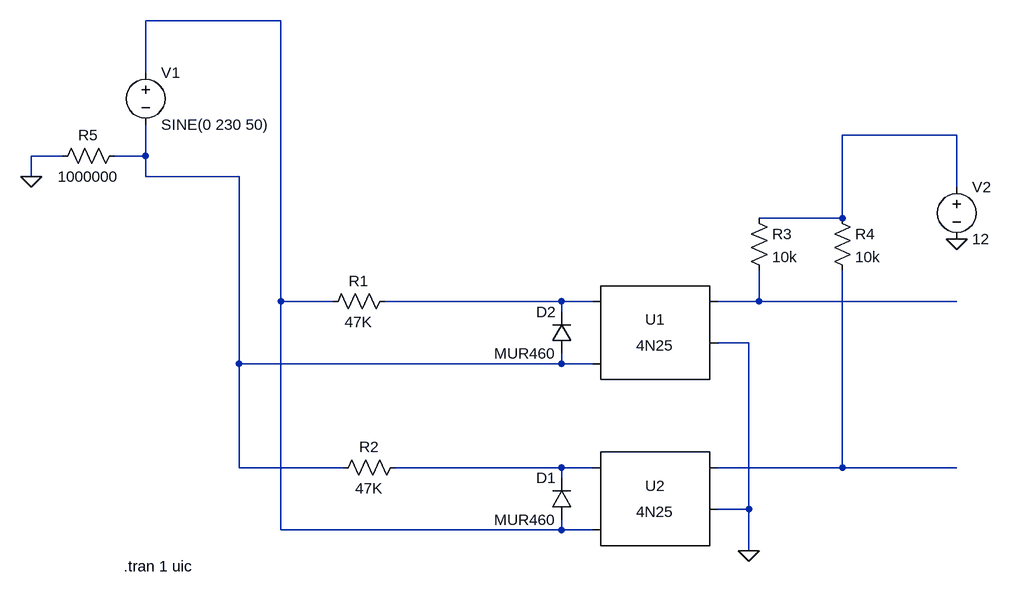
[diagram p0: schematic zcd-sim.asc]
zcd-sim.asc, the LTspice schematic file:
Version 4
SHEET 1 880 680
WIRE -368 -336 -576 -336
WIRE -576 -256 -576 -336
WIRE 672 -160 496 -160
WIRE -704 -128 -752 -128
WIRE -576 -128 -576 -176
WIRE -576 -128 -624 -128
WIRE -752 -96 -752 -128
WIRE -576 -96 -576 -128
WIRE -432 -96 -576 -96
WIRE 672 -80 672 -160
WIRE 496 -32 496 -160
WIRE 496 -32 368 -32
WIRE -368 96 -368 -336
WIRE -288 96 -368 96
WIRE 64 96 -208 96
WIRE 112 96 64 96
WIRE 368 96 368 48
WIRE 368 96 304 96
WIRE 672 96 368 96
WIRE 64 112 64 96
WIRE 352 160 304 160
WIRE -432 192 -432 -96
WIRE 64 192 64 176
WIRE 64 192 -432 192
WIRE 112 192 64 192
WIRE -432 352 -432 192
WIRE -272 352 -432 352
WIRE 64 352 -192 352
WIRE 112 352 64 352
WIRE 496 352 496 48
WIRE 496 352 304 352
WIRE 672 352 496 352
WIRE 64 368 64 352
WIRE 352 416 352 160
WIRE 352 416 304 416
WIRE -368 448 -368 96
WIRE 64 448 64 432
WIRE 64 448 -368 448
WIRE 112 448 64 448
WIRE 352 480 352 416
FLAG 672 0 0
FLAG 352 480 0
FLAG -752 -96 0
SYMBOL Optos\\4N25 208 160 R0
SYMATTR InstName U1
SYMBOL Optos\\4N25 208 416 R0
SYMATTR InstName U2
SYMBOL res -192 80 R90
WINDOW 0 0 56 VBottom 2
WINDOW 3 32 56 VTop 2
SYMATTR InstName R1
SYMATTR Value 47K
SYMBOL voltage -576 -272 R0
WINDOW 123 0 0 Left 0
WINDOW 39 0 0 Left 0
SYMATTR InstName V1
SYMATTR Value SINE(0 230 50)
SYMBOL voltage 672 -96 R0
WINDOW 123 0 0 Left 0
WINDOW 39 0 0 Left 0
SYMATTR InstName V2
SYMATTR Value 12
SYMBOL res 352 -48 R0
SYMATTR InstName R3
SYMATTR Value 10k
SYMBOL res 480 -48 R0
SYMATTR InstName R4
SYMATTR Value 10k
SYMBOL res -608 -144 R90
WINDOW 0 0 56 VBottom 2
WINDOW 3 32 56 VTop 2
SYMATTR InstName R5
SYMATTR Value 1000000
SYMBOL diode 80 176 R180
WINDOW 0 24 64 Left 2
WINDOW 3 24 0 Left 2
SYMATTR InstName D2
SYMATTR Value MUR460
SYMBOL diode 80 432 R180
WINDOW 0 24 64 Left 2
WINDOW 3 24 0 Left 2
SYMATTR InstName D1
SYMATTR Value MUR460
SYMBOL res -176 336 R90
WINDOW 0 0 56 VBottom 2
WINDOW 3 32 56 VTop 2
SYMATTR InstName R2
SYMATTR Value 47K
TEXT -610 504 Left 2 !.tran 1 uic

The netlist it stands for:
* zcd-sim.asc
XU1 N004 N003 N005 0 NC_01 4N25
XU2 N006 N001 N007 0 NC_02 4N25
R1 N004 N001 47K
V1 N001 N003 SINE(0 230 50)
V2 N002 0 12
R3 N002 N005 10k
R4 N002 N007 10k
R5 N003 0 1000000
D2 N003 N004 MUR460
D1 N001 N006 MUR460
R2 N006 N003 47K
.model D D
.lib standard.dio
.tran 1 uic
.lib 4N25.sub
.backanno
.end